# EAGLE schematic Display (EAGLE 9.0.1)
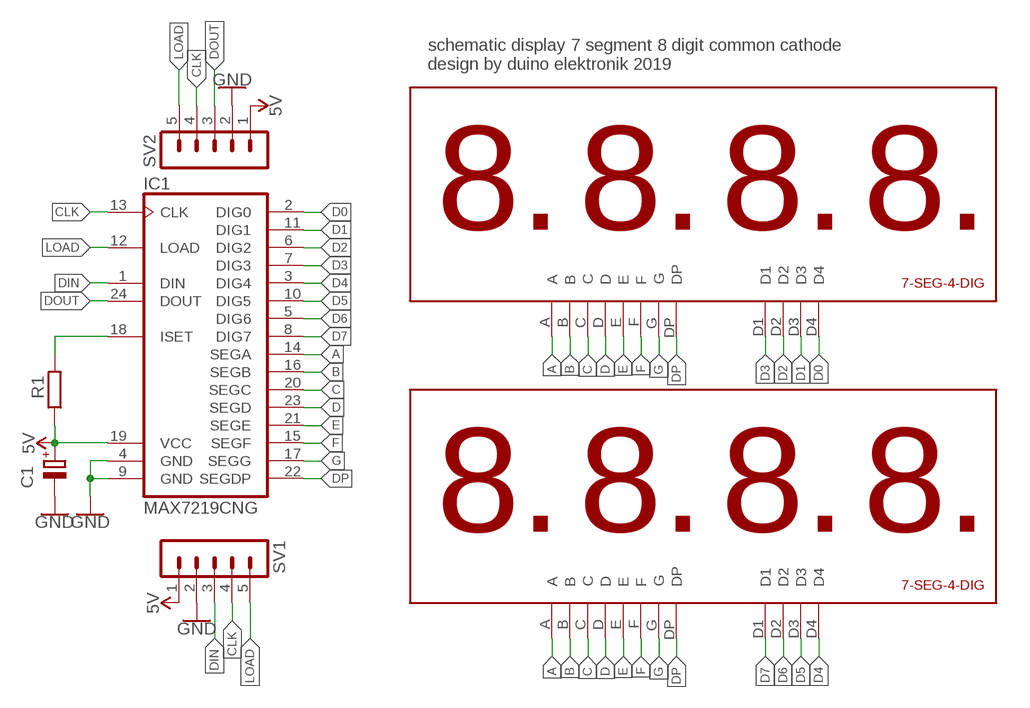
[diagram p0: schematic, sheet 1]

## Parts
C1  CPOL-EUE1.8-4  [E1,8-4]
IC1  MAX7219CNG  [DIL24-3]
R1  R-EU_0207/10  [0207/10]
SV1  MA05-1  [MA05-1]
SV2  MA05-1  [MA05-1]
U$1  7-SEG-4-DIG7-SEG-4-DIG  [7-SEG-4-DIG]
U$2  7-SEG-4-DIG7-SEG-4-DIG  [7-SEG-4-DIG]

## Nets
5V: C1.+ IC1.19(VCC) R1.1 SV1.1 SV2.1
A: IC1.14(SEGA) U$1.A U$2.A
B: IC1.16(SEGB) U$1.B U$2.B
C: IC1.20(SEGC) U$1.C U$2.C
CLK: IC1.13(CLK) SV1.4 SV2.4
D: IC1.23(SEGD) U$1.D U$2.D
D0: IC1.2(DIG0) U$1.D4
D1: IC1.11(DIG1) U$1.D3
D2: IC1.6(DIG2) U$1.D2
D3: IC1.7(DIG3) U$1.D1
D4: IC1.3(DIG4) U$2.D4
D5: IC1.10(DIG5) U$2.D3
D6: IC1.5(DIG6) U$2.D2
D7: IC1.8(DIG7) U$2.D1
DIN: IC1.1(DIN) SV1.3
DOUT: IC1.24(DOUT) SV2.3
DP: IC1.22(SEGDP) U$1.DP U$2.DP
E: IC1.21(SEGE) U$1.E U$2.E
F: IC1.15(SEGF) U$1.F U$2.F
G: IC1.17(SEGG) U$1.G U$2.G
GND: C1.- IC1.4(GND) IC1.9(GND) SV1.2 SV2.2
LOAD: IC1.12(LOAD) SV1.5 SV2.5
N$2: IC1.18(ISET) R1.2

## Notes on the sheet
- schematic display 7 segment 8 digit common cathode
  design by duino elektronik 2019

## Library data of the parts
C1 = rcl:CPOL-EU: POLARIZED CAPACITOR, European symbol; SPICEPREFIX: C
IC1 = max7219:MAX7219CNG: LED DISPLAY DRIVER; MF: MAXIM; MPN: MAX7219CNG; OC_FARNELL: 1523914; OC_NEWARK: 34C4018
R1 = rcl:R-EU_: RESISTOR, European symbol; SPICEPREFIX: R
SV1 SV2 = con-lstb:MA05-1: PIN HEADER; OC_FARNELL: unknown; OC_NEWARK: unknown
U$1 U$2 = 7-SEG-4-DIG:7-SEG-4-DIG